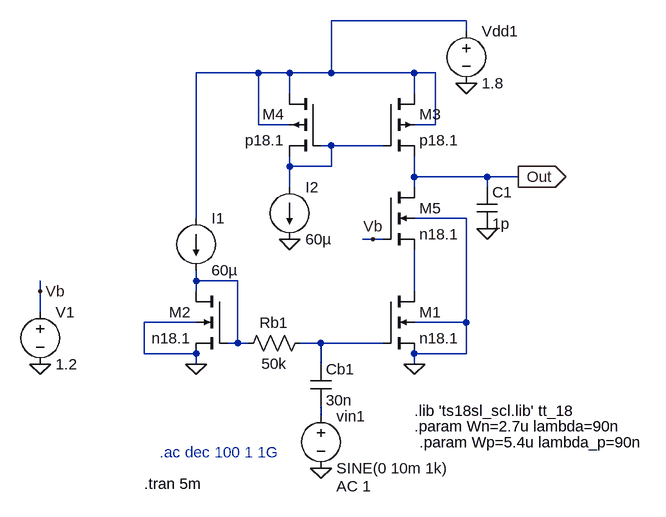
[diagram p0: schematic q4_3.asc]
q4_3.asc, the LTspice schematic file:
Version 4.1
SHEET 1 880 680
WIRE 368 -128 160 -128
WIRE 368 -112 368 -128
WIRE 48 -48 -48 -48
WIRE 96 -48 48 -48
WIRE 160 -48 160 -128
WIRE 160 -48 96 -48
WIRE 288 -48 160 -48
WIRE 320 -48 288 -48
WIRE 96 -16 96 -48
WIRE 288 -16 288 -48
WIRE 48 32 48 -48
WIRE 96 32 48 32
WIRE 320 32 320 -48
WIRE 320 32 288 32
WIRE 160 64 144 64
WIRE 240 64 160 64
WIRE 96 96 96 80
WIRE 160 96 160 64
WIRE 160 96 96 96
WIRE 288 112 288 80
WIRE 400 112 288 112
WIRE 448 112 400 112
WIRE 96 128 96 96
WIRE 288 128 288 112
WIRE 400 128 400 112
WIRE -48 176 -48 -48
WIRE 368 176 288 176
WIRE 224 208 208 208
WIRE 240 208 224 208
WIRE -48 272 -48 256
WIRE 16 272 -48 272
WIRE -288 288 -288 272
WIRE -48 288 -48 272
WIRE 288 288 288 224
WIRE -288 320 -288 288
WIRE -48 336 -128 336
WIRE 368 336 368 176
WIRE 368 336 288 336
WIRE 16 368 16 272
WIRE 16 368 0 368
WIRE 32 368 16 368
WIRE 144 368 112 368
WIRE 240 368 144 368
WIRE -128 384 -128 336
WIRE -48 384 -128 384
WIRE 368 384 368 336
WIRE 368 384 288 384
WIRE -48 400 -48 384
WIRE 144 400 144 368
WIRE 288 400 288 384
WIRE 144 480 144 464
FLAG 368 -32 0
FLAG 288 400 0
FLAG 144 560 0
FLAG -48 400 0
FLAG 448 112 Out
IOPIN 448 112 Out
FLAG 96 208 0
FLAG -288 400 0
FLAG -288 288 Vb
FLAG 224 208 Vb
FLAG 400 192 0
SYMBOL voltage 368 -128 R0
WINDOW 123 0 0 Left 0
WINDOW 39 0 0 Left 0
SYMATTR InstName Vdd1
SYMATTR Value 1.8
SYMBOL nmos4 240 288 R0
SYMATTR InstName M1
SYMATTR Value n18.1
SYMATTR Value2 l={2*lambda} w={Wn} ad={5*lambda*Wn} as={5*lambda*Wn} pd={2*Wn + 10*lambda} ps={2*Wn + 10*lambda}
SYMBOL cap 128 400 R0
SYMATTR InstName Cb1
SYMATTR Value 30n
SYMBOL voltage 144 464 R0
WINDOW 123 24 124 Left 2
WINDOW 39 0 0 Left 0
SYMATTR Value2 AC 1
SYMATTR InstName vin1
SYMATTR Value SINE(0 10m 1k)
SYMBOL res 128 352 R90
WINDOW 0 0 56 VBottom 2
WINDOW 3 32 56 VTop 2
SYMATTR InstName Rb1
SYMATTR Value 50k
SYMBOL nmos4 0 288 M0
SYMATTR InstName M2
SYMATTR Value n18.1
SYMATTR Value2 l={2*lambda} w={Wn} ad={5*lambda*Wn} as={5*lambda*Wn} pd={2*Wn + 10*lambda} ps={2*Wn + 10*lambda}
SYMBOL current -48 176 R0
WINDOW 123 0 0 Left 0
WINDOW 39 0 0 Left 0
SYMATTR InstName I1
SYMATTR Value 60µ
SYMBOL pmos4 240 -16 R0
SYMATTR InstName M3
SYMATTR Value p18.1
SYMATTR Value2 l={2*lambda_p} w={Wp} ad={5*lambda_p*Wp} as={5*lambda_p*Wp} pd={2*Wp + 10*lambda_p} ps={2*Wp + 10*lambda_p}
SYMBOL current 96 128 R0
WINDOW 123 0 0 Left 0
WINDOW 39 0 0 Left 0
SYMATTR InstName I2
SYMATTR Value 60µ
SYMBOL pmos4 144 -16 M0
SYMATTR InstName M4
SYMATTR Value p18.1
SYMATTR Value2 l={2*lambda_p} w={Wp} ad={5*lambda_p*Wp} as={5*lambda_p*Wp} pd={2*Wp + 10*lambda_p} ps={2*Wp + 10*lambda_p}
SYMBOL nmos4 240 128 R0
SYMATTR InstName M5
SYMATTR Value n18.1
SYMATTR Value2 l={2*lambda} w={Wn} ad={5*lambda*Wn} as={5*lambda*Wn} pd={2*Wn + 10*lambda} ps={2*Wn + 10*lambda}
SYMBOL voltage -288 304 R0
WINDOW 123 0 0 Left 0
WINDOW 39 0 0 Left 0
SYMATTR InstName V1
SYMATTR Value 1.2
SYMBOL cap 384 128 R0
SYMATTR InstName C1
SYMATTR Value 1p
TEXT 288 496 Left 2 !.param Wn=2.7u lambda=90n
TEXT 288 472 Left 2 !.lib 'ts18sl_scl.lib' tt_18
TEXT -128 584 Left 2 !.tran 5m
TEXT -104 536 Left 2 ;.ac dec 100 1 1G
TEXT 296 520 Left 2 !.param Wp=5.4u lambda_p=90n

The netlist it stands for:
* q4_3.asc
Vdd1 N001 0 1.8
M1 N004 N005 0 0 n18.1 l={2*lambda} w={Wn} ad={5*lambda*Wn} as={5*lambda*Wn} pd={2*Wn + 10*lambda} ps={2*Wn + 10*lambda}
Cb1 N005 N006 30n
vin1 N006 0 SINE(0 10m 1k) AC 1
Rb1 N005 N003 50k
M2 N003 N003 0 0 n18.1 l={2*lambda} w={Wn} ad={5*lambda*Wn} as={5*lambda*Wn} pd={2*Wn + 10*lambda} ps={2*Wn + 10*lambda}
I1 N001 N003 60µ
M3 N001 N002 Out N001 p18.1 l={2*lambda_p} w={Wp} ad={5*lambda_p*Wp} as={5*lambda_p*Wp} pd={2*Wp + 10*lambda_p} ps={2*Wp + 10*lambda_p}
I2 N002 0 60µ
M4 N001 N002 N002 N001 p18.1 l={2*lambda_p} w={Wp} ad={5*lambda_p*Wp} as={5*lambda_p*Wp} pd={2*Wp + 10*lambda_p} ps={2*Wp + 10*lambda_p}
M5 Out Vb N004 0 n18.1 l={2*lambda} w={Wn} ad={5*lambda*Wn} as={5*lambda*Wn} pd={2*Wn + 10*lambda} ps={2*Wn + 10*lambda}
V1 Vb 0 1.2
C1 Out 0 1p
.model NMOS NMOS
.model PMOS PMOS
.lib standard.mos
.param Wn=2.7u lambda=90n
.lib 'ts18sl_scl.lib' tt_18
.tran 5m
* .ac dec 100 1 1G
.param Wp=5.4u lambda_p=90n
.backanno
.end